# Altium schematic sheet Supply.SchDoc
size A2; Date: Date; CompanyName: HESSO; Engineer: Name; Address1: Route du Rawyl 47; Address2: 1950 Sion; Address3: Switzerland; DocumentNumber: 3; SheetNumber: 3; SheetTotal: 3; ProjectName: Project Name
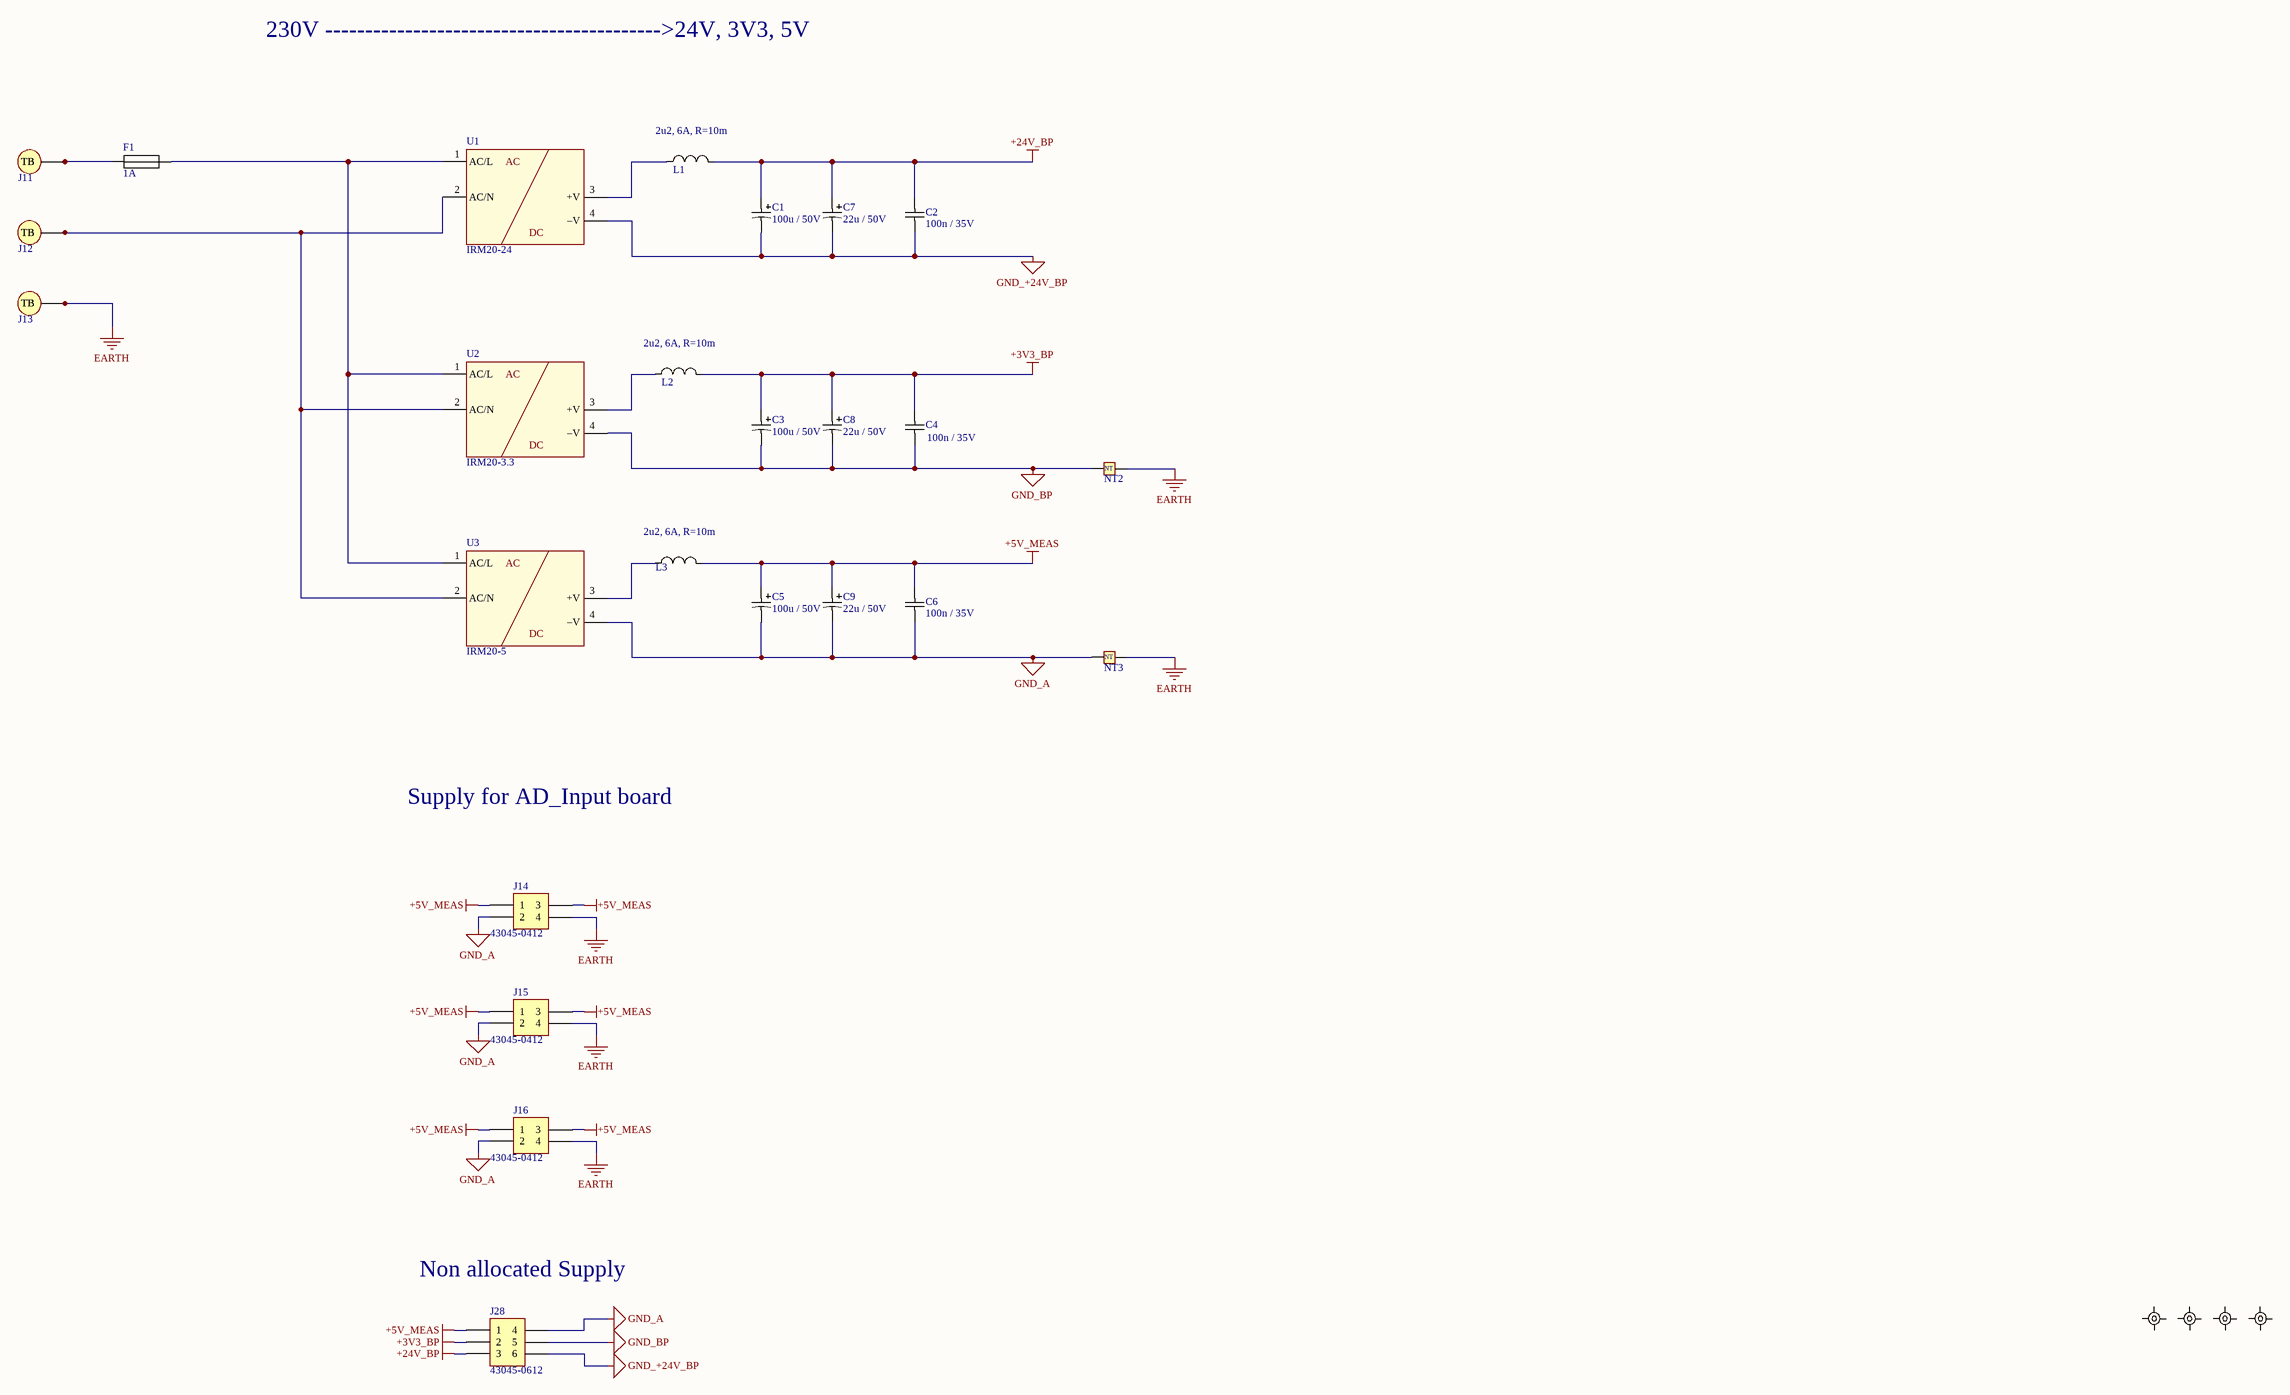
[diagram p0: Supply.SchDoc]

## Parts
C1  100u / 50V  [Capacitor POL P3.5 D8.0 H13.0]
C2  100n / 35V  [Capacitor P2.5 C4.5x2.5 H4.0]
C3  100u / 50V  [Capacitor POL P3.5 D8.0 H13.0]
C4  100n / 35V  [Capacitor P2.5 C4.5x2.5 H4.0]
C5  100u / 50V  [Capacitor POL P3.5 D8.0 H13.0]
C6  100n / 35V  [Capacitor P2.5 C4.5x2.5 H4.0]
C7  22u / 50V  [Capacitor POL P2.00 D5.5 H12.0]
C8  22u / 50V  [Capacitor POL P2.00 D5.5 H12.0]
C9  22u / 50V  [Capacitor POL P2.00 D5.5 H12.0]
F1  1A  [Fuse Cartridge 5x20 Shurter]
J11  1790351  [PC FFKDSA/H1-7,62 - 1790351]  (value not drawn)
J12  1790351  [PC FFKDSA/H1-7,62 - 1790351]  (value not drawn)
J13  1790351  [PC FFKDSA/H1-7,62 - 1790351]  (value not drawn)
J14  43045-0412  [MOLEX 43045-0412]
J15  43045-0412  [MOLEX 43045-0412]
J16  43045-0412  [MOLEX 43045-0412]
J28  43045-0612  [MOLEX 43045-0612]
L1  2u2, 6A, R=10m  [L P5.0 D10.0 H13.0]
L2  2u2, 6A, R=10m  [L P5.0 D10.0 H13.0]
L3  2u2, 6A, R=10m  [L P5.0 D10.0 H13.0]
NT2  Net Tie  [NET TIE 1005]  (value not drawn)  (net tie, no BOM)
NT3  Net Tie  [NET TIE 1005]  (value not drawn)  (net tie, no BOM)
U1  IRM20-24  [MEAN WELL IRM-20 Series]
U2  IRM20-3.3  [MEAN WELL IRM-20 Series]
U3  IRM20-5  [MEAN WELL IRM-20 Series]
Z1  1 - 3  [FIDUCIAL]  (value not drawn)
Z2  1 - 3  [FIDUCIAL]  (value not drawn)
Z3  1 - 3  [FIDUCIAL]  (value not drawn)
Z4  1 - 3  [FIDUCIAL]  (value not drawn)

## Nets
+3V3_BP: C3.1 C4.2 C8.1 J28.2 L2.2
+5V_MEAS: C5.1 C6.2 C9.1 J14.1 J14.3 J15.1 J15.3 J16.1 J16.3 J28.1 L3.2
+24V_BP: C1.1 C2.2 C7.1 J28.3 L1.2
EARTH: J13.1(TB) J13.2(TB) J14.4 J15.4 J16.4 NT2.2 NT3.2
GND_+24V_BP: C1.2 C2.1 C7.2 J28.6 U1.4(–V)
GND_A: C5.2 C6.1 C9.2 J14.2 J15.2 J16.2 J28.4 NT3.1 U3.4(–V)
GND_BP: C3.2 C4.1 C8.2 J28.5 NT2.1 U2.4(–V)
NetF1_1: F1.1 J11.1(TB) J11.2(TB)
NetF1_2: F1.2 U1.1(AC/L) U2.1(AC/L) U3.1(AC/L)
NetJ12_1: J12.1(TB) J12.2(TB) U1.2(AC/N) U2.2(AC/N) U3.2(AC/N)
NetL1_1: L1.1 U1.3(+V)
NetL2_1: L2.1 U2.3(+V)
NetL3_1: L3.1 U3.3(+V)

## Notes on the sheet
- 230V ------------------------------------------>24V, 3V3, 5V
- Supply for AD_Input board
- Non allocated Supply
- Date :
- Revision :
- Sheet
- of
- Design by :
- (in symbol MEAN WELL IRM-20 series) AC; DC
- (in symbol Net Tie) NT

## Library data of the parts
C1 C3 C5 C7-C9 = Capacitor Polarized: Manufacturer: Panasonic
  C1 C3 C5: Value: 100u / 50V; Mouser No.: 667-EEU-FR1H101
  C7-C9: Value: 22u / 50V; Mouser No.: 667-EEU-FR1H220
C2 C4 C6 = Capacitor: Value: 100n / 35V
F1 = Fuse Cartridge 5x20: Value: 1A
J11-J13 = PC FFKDSA/H1-7,62 - 1790351: Phoenix Contact PCB terminal block - FFKDSA/H1-7,62 - 1790351; Value: 1790351
J14-J16 = MOLEX 43045-0412: Micro-Fit 3.0 Vertical Header, 3.00mm Pitch, Dual Row, 4 Circuits; Manufacturer: Molex; Mouser No.: 538-43045-0412; Value: 43045-0412
J28 = MOLEX 43045-0612: Micro-Fit 3.0 Vertical Header, 3.00mm Pitch, Dual Row, 6 Circuits; Manufacturer: Molex; Mouser No.: 538-43045-0612; Value: 43045-0612
L1-L3 = Inductor: Manufacturer: Fastron; Value: 2u2, 6A, R=10m; Mouser No.: 434-07HCP-2R2M
NT2 NT3 = Net Tie: Connection for 2 different NETNAME
U1-U3 = MEAN WELL IRM-20 series: AC-DC 20W Single Output Encapsulated Type Converter
  U1: Value: IRM20-24
  U2: Value: IRM20-3.3
  U3: Value: IRM20-5
Z1-Z4 = FIDUCIAL: FIDUCIAL Din 1mm Dout 3mm; Value: 1 - 3